# EAGLE design atmega32u4bb (EAGLE 5.11)
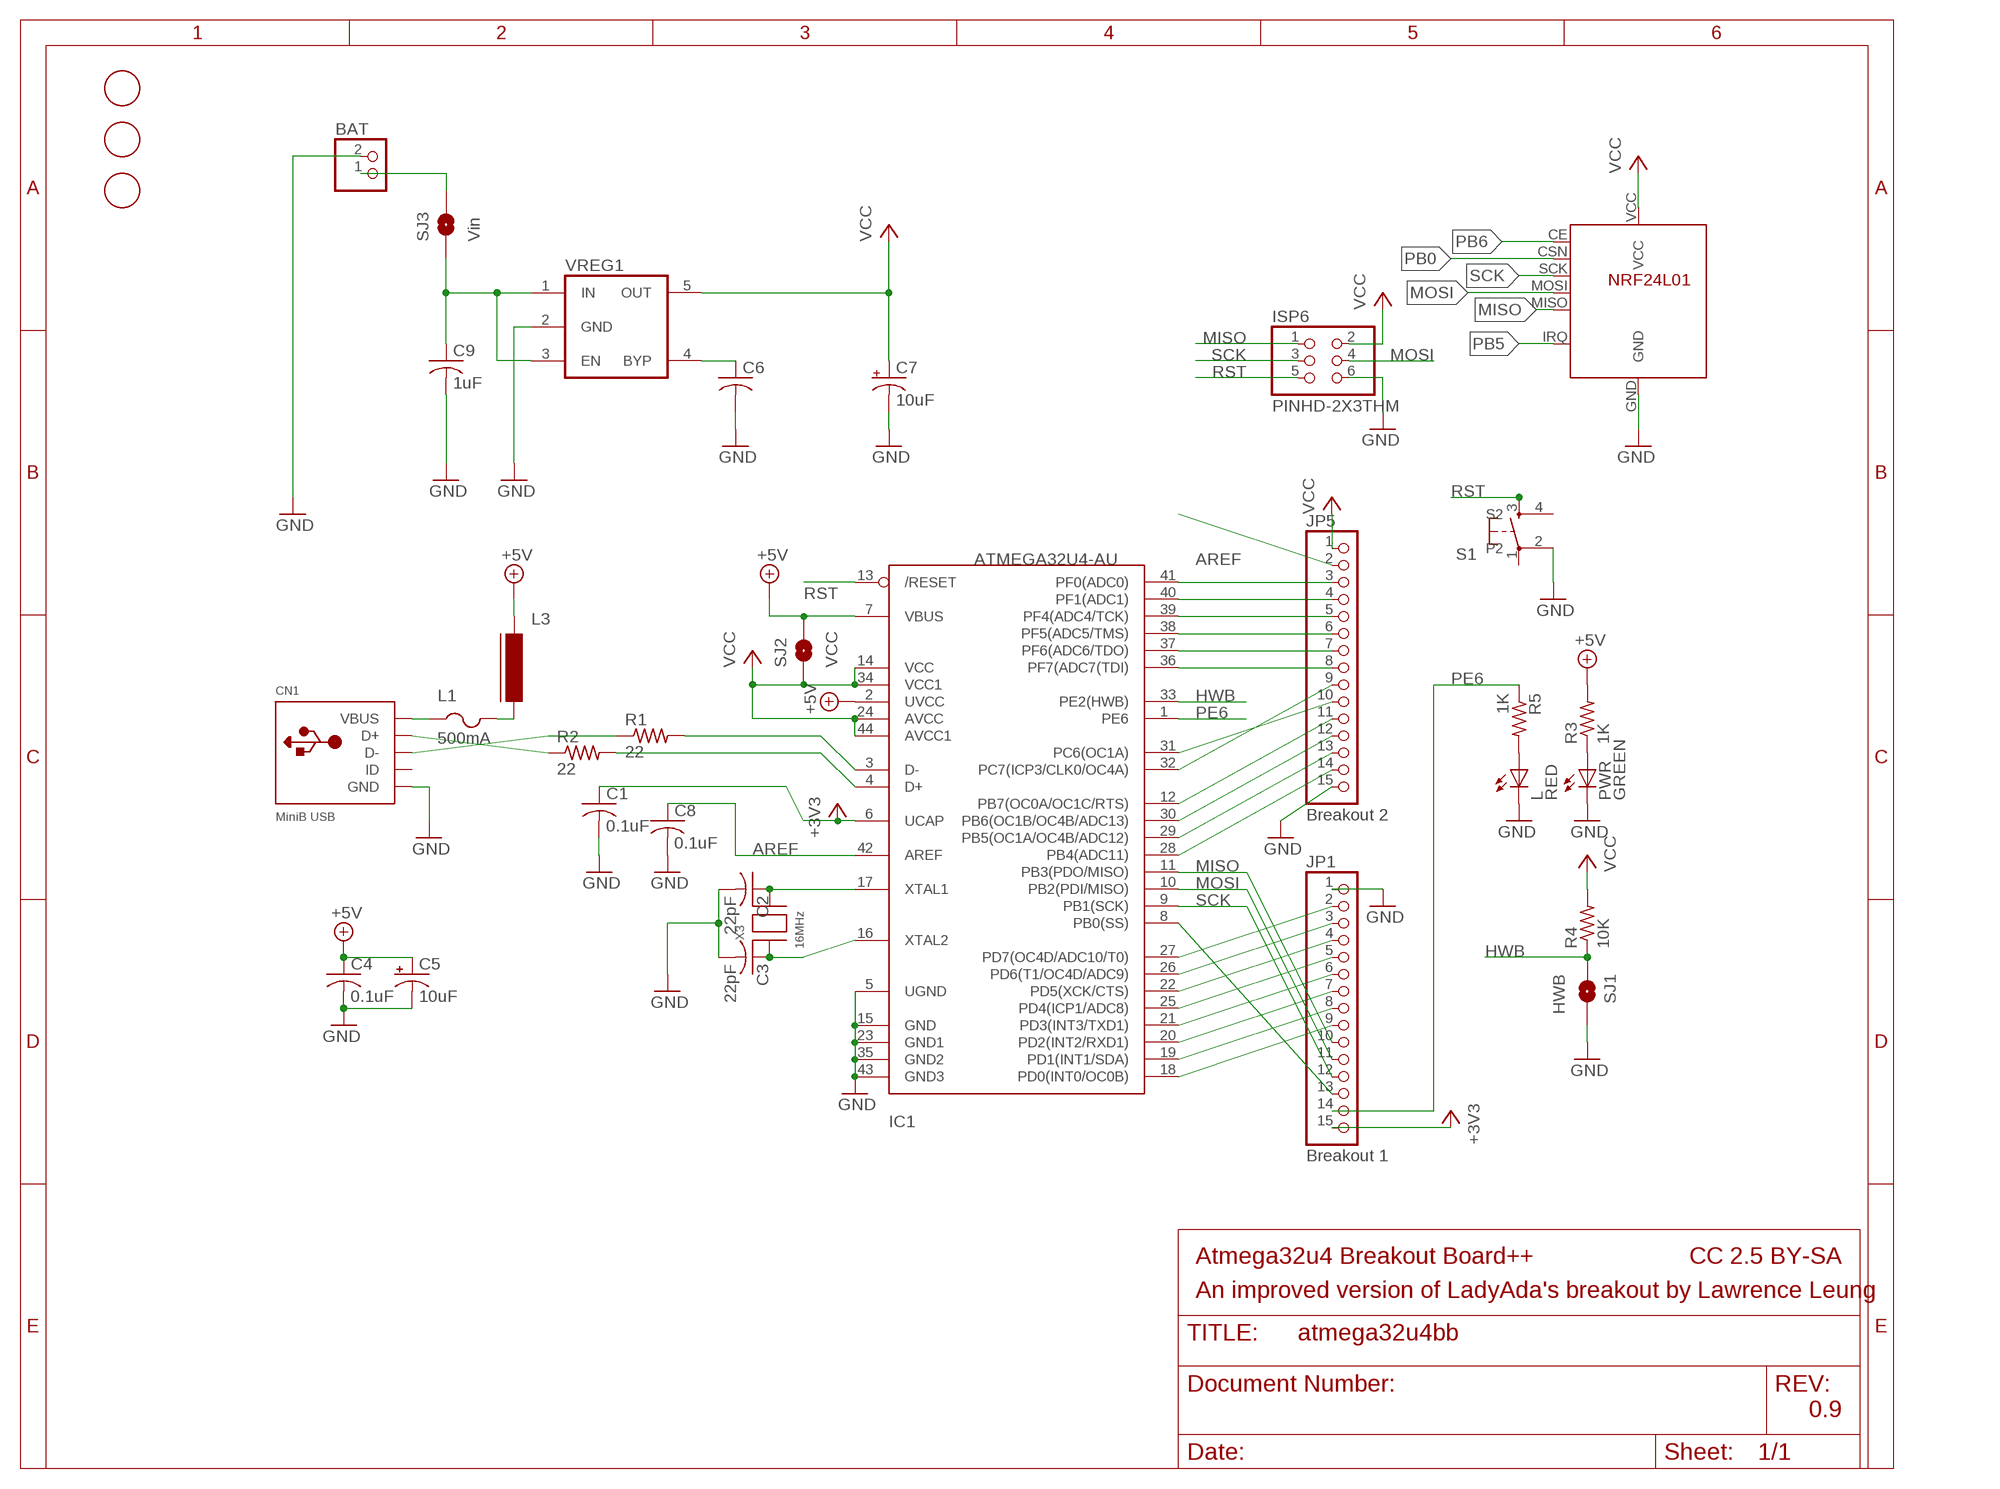
[diagram p0: schematic, sheet 1]

## Parts
BAT  JST_2PIN-THM-RA  [JST-PH-2-THM-RA]
C1  0.1uF  C-USC0603  [C0603]
C2  22pF  C-USC0603  [C0603]
C3  22pF  C-USC0603  [C0603]
C4  0.1uF  C-USC0603  [C0603]
C5  10uF  CPOL-USA/3216-18R  [A/3216-18R]
C6  C-USC0603  [C0603]
C7  10uF  CPOL-USA/3216-18R  [A/3216-18R]
C8  0.1uF  C-USC0603  [C0603]
C9  1uF  C-USC0603  [C0603]
CN1  MiniB USB  USBMINIB  [USB-MINIB]
IC1  ATMEGA32U4-AU  [TQFP44]
ISP6  PINHD-2X3THM  [ISP6]
JP1  Breakout 1  PINHD-1X15-CB  [1X15-CB]
JP5  Breakout 2  PINHD-1X15-CB  [1X15-CB]
L  RED  LEDCHIPLED_0805  [CHIPLED_0805]
L1  500mA  PTCFUSE-1206  [R1206]
L3  FERRITE-0603  [FB603]
PWR  GREEN  LEDCHIPLED_0805  [CHIPLED_0805]
R1  22  R-US_R0603  [R0603]
R2  22  R-US_R0603  [R0603]
R3  1K  R-US_R0603  [R0603]
R4  10K  R-US_R0603  [R0603]
R5  1K  R-US_R0603  [R0603]
RF1  NRF24L01-BREAKOUT  [NRF24L01-BREAKOUT-ITEAD]
S1  KMS221G  [KMS221G]
SJ1  HWB  SOLDERJUMPERTRACE  [SJ_2S-TRACE]
SJ2  VCC  SOLDERJUMPERTRACE  [SJ_2S-TRACE]
SJ3  Vin  SOLDERJUMPERTRACE  [SJ_2S-TRACE]
U$1  FIDUCIAL  [FIDUCIAL_1MM]
U$2  FIDUCIAL  [FIDUCIAL_1MM]
U$6  FIDUCIAL  [FIDUCIAL_1MM]
VREG1  IC_VREG_5PINS-SOT-23-5  [SOT-23-5]
X3  16MHz  XTALNX5032  [NX5032]

## Nets
+3V3: C1.1 IC1.6(UCAP) JP1.15
+5V: C4.1 C5.+ IC1.2(UVCC) IC1.7(VBUS) L3.1 R3.2 SJ2.2
AREF: C8.1 IC1.42(AREF) JP5.2
GND: BAT.2 C1.2 C2.2 C3.2 C4.2 C5.- C6.2 C7.- C8.2 C9.2 CN1.GND IC1.5(UGND) IC1.15(GND) IC1.23(GND1) IC1.35(GND2) IC1.43(GND3) ISP6.6 JP1.1 JP5.15 L.C PWR.C RF1.GND S1.2 SJ1.2 VREG1.2(GND)
HWB: IC1.33(PE2(HWB)) R4.1 SJ1.1
MISO: IC1.11(PB3(PDO/MISO)) ISP6.1 JP1.10 RF1.MISO
MOSI: IC1.10(PB2(PDI/MISO)) ISP6.4 JP1.11 RF1.MOSI
N$1: PWR.A R3.1
N$2: CN1.D+ R2.1
N$3: IC1.3(D-) R1.2
N$4: IC1.4(D+) R2.2
N$5: CN1.D- R1.1
N$6: L1.2 L3.2
N$7: L.A R5.2
N$8: C2.1 IC1.17(XTAL1) X3.P$2
N$9: C3.1 IC1.16(XTAL2) X3.P$1
N$12: C6.1 VREG1.4(BYP)
PB0: IC1.8(PB0(SS)) JP1.13 RF1.CSN
PB4: IC1.28(PB4(ADC11)) JP5.14
PB5: IC1.29(PB5(OC1A/OC4B/ADC12)) JP5.13 RF1.IRQ
PB6: IC1.30(PB6(OC1B/OC4B/ADC13)) JP5.12 RF1.CE
PB7: IC1.12(PB7(OC0A/OC1C/RTS)) JP5.11
PC6: IC1.31(PC6(OC1A)) JP5.10
PC7: IC1.32(PC7(ICP3/CLK0/OC4A)) JP5.9
PD0: IC1.18(PD0(INT0/OC0B)) JP1.9
PD1: IC1.19(PD1(INT1/SDA)) JP1.8
PD2: IC1.20(PD2(INT2/RXD1)) JP1.7
PD3: IC1.21(PD3(INT3/TXD1)) JP1.6
PD4: IC1.25(PD4(ICP1/ADC8)) JP1.5
PD5: IC1.22(PD5(XCK/CTS)) JP1.4
PD6: IC1.26(PD6(T1/OC4D/ADC9)) JP1.3
PD7: IC1.27(PD7(OC4D/ADC10/T0)) JP1.2
PE6: IC1.1(PE6) JP1.14 R5.1
PF0: IC1.41(PF0(ADC0)) JP5.3
PF1: IC1.40(PF1(ADC1)) JP5.4
PF4: IC1.39(PF4(ADC4/TCK)) JP5.5
PF5: IC1.38(PF5(ADC5/TMS)) JP5.6
PF6: IC1.37(PF6(ADC6/TDO)) JP5.7
PF7: IC1.36(PF7(ADC7(TDI)) JP5.8
RST: IC1.13(/RESET) ISP6.5 S1.3(S)
SCK: IC1.9(PB1(SCK)) ISP6.3 JP1.12 RF1.SCK
VBAT: BAT.1 SJ3.2
VBUS: CN1.VBUS L1.1
VCC: C7.+ IC1.14(VCC) IC1.24(AVCC) IC1.34(VCC1) IC1.44(AVCC1) ISP6.2 JP5.1 R4.2 RF1.VCC SJ2.1
VIN: C9.1 SJ3.1 VREG1.1(IN) VREG1.3(EN)
Unconnected: CN1.ID S1.1(P) S1.4(S2) VREG1.5(OUT)

## Notes on the sheet
- Atmega32u4 Breakout Board++ | CC 2.5 BY-SA
- An improved version of LadyAda's breakout by Lawrence Leung
- 0.9

## Library data of the parts
BAT = adafruit:JST_2PIN: JST 2-Pin Connectors of various flavors SMT-RA (S2B-PH-SM4) 4UConnector #17311 SMT (B2B-PH-SM4) THM-RA (S2B-PH) THM (B2B-PH)
C1-C4 C6 C8 C9 = LL:C-US: CAPACITOR, American symbol
C5 C7 = LL:CPOL-US: POLARIZED CAPACITOR, American symbol Footprints somewhat modified from Adafruits (1206)
CN1 = adafruit:USB: USB Connectors USBMINIB - Surface Mount Female Mini-B USB Connector 4UConnector: 06564 By microbuilder.eu Thru-hole RA Female Mini-B USB Connector 4UConnector: 18732 By ladyada.net
IC1 = adaprog:ATMEGA32U4
ISP6 = adaprog:PINHD-2X3
JP1 JP5 = adafruit:PINHD-1X15: PIN HEADER
L PWR = adafruit:LED: LED OSRAM: - CHIPLED LG R971, LG N971, LY N971, LG Q971, LY Q971, LO R971, LY R971 LH N974, LH R974 LS Q976, LO Q976, LY Q976 LO Q996 - Hyper CHIPLED LW Q18S LB Q993, LB Q99A, LB R99A - SideLED LS A670, LO A670, LY A670, LG A670, LP A670 LB A673, LV A673, LT A673, LW A673 LH A674 LY A675 LS A676, LA A676, LO A676, LY A676, LW A676 LS A679, LY A679, LG A679 - Hyper Micro SIDELED® LS Y876, LA Y876, LO Y876, LY Y876 LT Y87S - SmartLED LW L88C, LW L88S LB L89C, LB L89S, LG L890 LS L89K, LO L89K, LY L89K LS L896, LA L896, LO L896, LY L896 - TOPLED LS T670, LO T670, LY T670, LG T670, LP T670 LSG T670, LSP T670, LSY T670, LOP T670, LYG T670 LG T671, LOG T671, LSG T671 LB T673, LV T673, LT T673, LW T673 LH T674 LS T676, LA T676, LO T676, LY T676, LB T676, LH T676, LSB T676, LW T676 LB T67C, LV T67C, LT T67C, LS T67K, LO T67K, LY T67K, LW E67C LS E67B, LA E67B, LO E67B, LY E67B, LB E67C, LV E67C, LT E67C LW T67C LS T679, LY T679, LG T679 LS T770, LO T770, LY T770, LG T770, LP T770 LB T773, LV T773, LT T773, LW T773 LH T774 LS E675, LA E675, LY E675, LS T675 LS T776, LA T776, LO T776, LY T776, LB T776 LHGB T686 LT T68C, LB T68C - Hyper Mini TOPLED® LB M676 - Mini TOPLED Santana® LG M470 LS M47K, LO M47K, LY M47K Source: http://www.osram.convergy.de/
L1 = adafruit:PTCFUSE: PTC fuses, resettable thermistors
L3 = dp_devices:FERRITE: Ferrite bead in various packages
R1-R5 = LL:R-US_: RESISTOR, American symbol
RF1 = LL:NRF24L01-BREAKOUT: NRF23L01 breakout; FREQ: 2.4GHZ
S1 = LL:KMS221G: LOW PROFILE PUSHBUTTON SWITCH KMS221G
SJ1-SJ3 = SparkFun:SOLDERJUMPER: Solder Jumper Standard SMD solder jumper. Used to automate production. Two varients : Normally Open and Normally Closed are the same, but have different paste layers. NC will have a large amount of paste and should jumper during reflow.
U$1 U$2 U$6 = adafruit:FIDUCIAL: For use by pick and place machines to calibrate the vision/machine, 1mm By microbuilder.eu
VREG1 = dp_devices:IC_VREG_5PINS: 5 pins voltage regulator
X3 = adaprog:XTAL

## Board
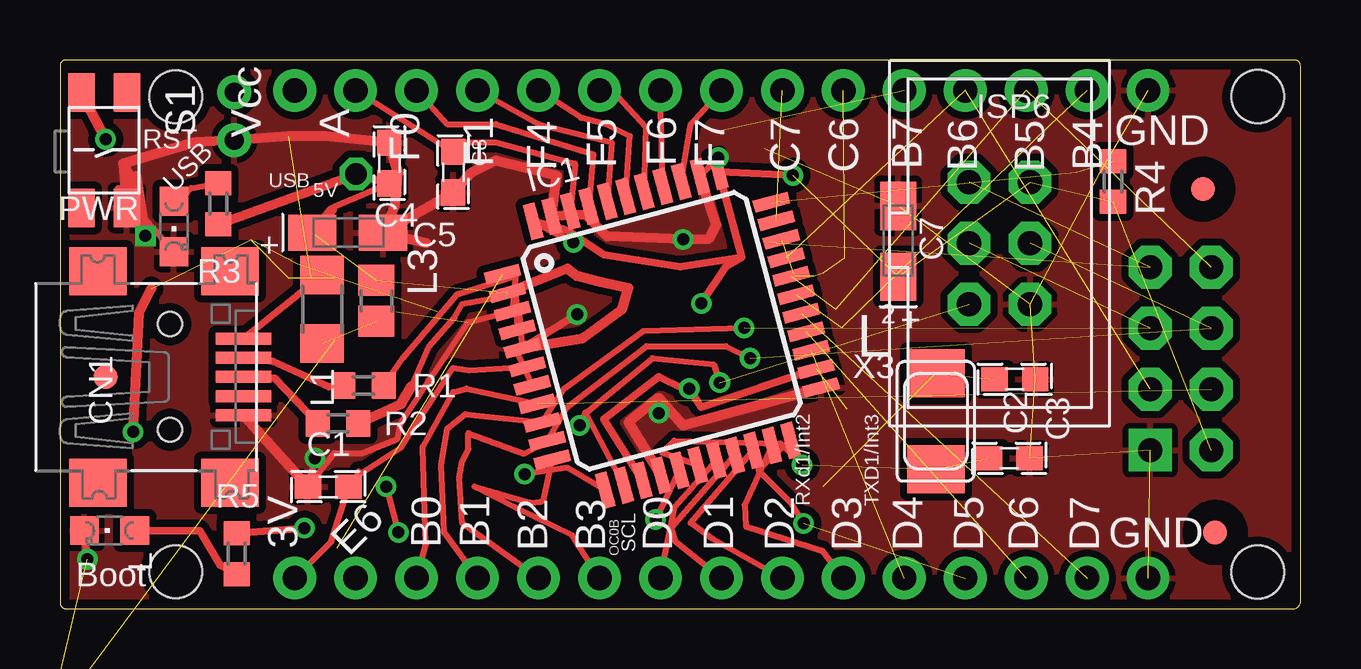
[diagram p1: board, top side]
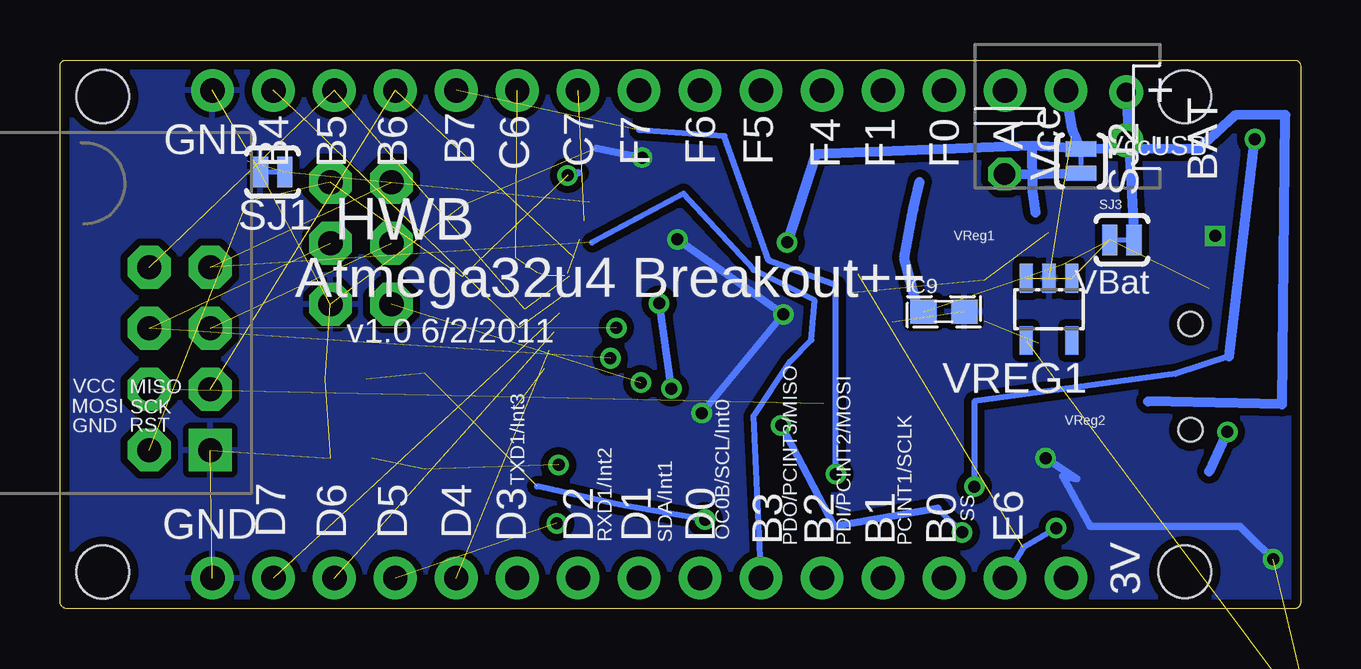
[diagram p2: board, bottom side, seen from below]

Size 51.69 x 22.87 mm. Coordinates in mm from the lower left corner, seen from the top.
Outline: 0.25,22.87 arc90 0,22.61 0,0.26 arc90 0.25,0.01 51.31,0.01 arc90 51.69,0.26 51.69,22.61 arc90 51.44,22.87 0.25,22.87
Copper layers (1*16): Top 0.0356mm / dielectric 1.5011mm / Bottom 0.0356mm
Design rules "LaenPCBOrder-LL": minimum track width 6mil, minimum drill 13mil, track to track 6mil, track to pad 6mil, pad to pad 6mil, via to via 6mil, smd to smd 6mil, copper to edge 15mil, drill to drill 6mil, minimum pad ring 7mil, minimum via ring 7mil, stop-mask expansion 4mil, vias tented up to drill 25mil, thermal gap 10mil
Holes 2.2 mm at 4.83,21.33 4.83,1.55 49.91,21.34 49.91,1.53

### Footprints (pad centres in the part's own frame; a part is rotated, then mirrored left to right if it is on the bottom)
JST-PH-2-THM-RA = drill 0.8 pad 1.422 round: 1 1,0; 2 -1,0
C0603 = smd 1.1 x 1: 1 -0.85,0; 2 0.85,0
A/3216-18R = smd 2.007 x 1.5: + 1.502,0 | smd 2.025 x 1.5: - -1.451,0
USB-MINIB = smd 0.5 x 2.308: D+ 0,4.064; D- -0.8,4.064; GND 1.6,4.064; ID 0.8,4.064; VBUS -1.6,4.064 | smd 2 x 2.4: GND1 -4.4,-2; GND2 -4.4,3.5; GND3 4.4,3.5; GND4 4.4,-2 | hole 1: -2.2,1; 2.2,1
TQFP44 = smd 1.5 x 0.5: 1 -5.8,4; 2 -5.8,3.2; 3 -5.8,2.4; 4 -5.8,1.6; 5 -5.8,0.8; 6 -5.8,0; 7 -5.8,-0.8; 8 -5.8,-1.6; 9 -5.8,-2.4; 10 -5.8,-3.2; 11 -5.8,-4; 23 5.8,-4; 24 5.8,-3.2; 25 5.8,-2.4; 26 5.8,-1.6; 27 5.8,-0.8; 28 5.8,0; 29 5.8,0.8; 30 5.8,1.6; 31 5.8,2.4; 32 5.8,3.2; 33 5.8,4 | smd 0.5 x 1.5: 12 -4,-5.8; 13 -3.2,-5.8; 14 -2.4,-5.8; 15 -1.6,-5.8; 16 -0.8,-5.8; 17 0,-5.8; 18 0.8,-5.8; 19 1.6,-5.8; 20 2.4,-5.8; 21 3.2,-5.8; 22 4,-5.8; 34 4,5.8; 35 3.2,5.8; 36 2.4,5.8; 37 1.6,5.8; 38 0.8,5.8; 39 0,5.8; 40 -0.8,5.8; 41 -1.6,5.8; 42 -2.4,5.8; 43 -3.2,5.8; 44 -4,5.8
ISP6 = drill 1.016 pad 1.778 octagon: 1 -2.54,-1.27; 2 -2.54,1.27; 3 0,-1.27; 4 0,1.27; 5 2.54,-1.27; 6 2.54,1.27
1X15-CB = drill 1.016 pad 1.778 round: 1 -17.78,0; 2 -15.24,0; 3 -12.7,0; 4 -10.16,0; 5 -7.62,0; 6 -5.08,0; 7 -2.54,0; 8 0,0; 9 2.54,0; 10 5.08,0; 11 7.62,0; 12 10.16,0; 13 12.7,0; 14 15.24,0; 15 17.78,0
CHIPLED_0805 = smd 1.2 x 1.2: A 0,-1.05; C 0,1.05
R1206 = smd 1.6 x 1.803: 1 -1.422,0; 2 1.422,0
FB603 = smd 1.3 x 1.5: 1 -0.85,0; 2 0.85,0
R0603 = smd 1 x 1.1: 1 -0.85,0; 2 0.85,0
NRF24L01-BREAKOUT-ITEAD = drill 1 pad 1.778 octagon: CE 13.306,-3.056; CSN 10.766,-3.056; IRQ 10.766,2.024; MISO 13.306,2.024; MOSI 10.766,-0.516; SCK 13.306,-0.516; VCC 10.766,-5.596 | drill 1 pad 1.778 square: GND 13.306,-5.596
KMS221G = smd 1.6 x 1.1: 1 -2.378,0.938; 2 2.422,0.938; 3 -2.378,-0.962; 4 2.422,-0.962
SJ_2S-TRACE = smd 0.635 x 1.27: 1 -0.508,0; 2 0.508,0
FIDUCIAL_1MM = smd 1 x 1: 1 0,0
SOT-23-5 = smd 0.55 x 1.2: 1 -0.95,-1.3; 2 0,-1.3; 3 0.95,-1.3; 4 0.95,1.3; 5 -0.95,1.3
NX5032 = smd 2 x 2.4: P$1 2,0; P$2 -2,0

### Placement (x,y rotation side)
BAT  7.26,20.53 90 bottom
C1  11.18,5.09 180 top
C2  39.55,6.27 0 top
C3  39.78,9.56 0 top
C4  13.73,18.57 90 top
C5  12.01,15.68 180 top
C6  -2.12,-8.12 0 top  (outside the outline)
C7  34.92,15.33 270 top
C8  16.38,18.19 270 top
C9  14.86,12.38 0 bottom
CN1  3.58,9.66 270 top
IC1  25.08,11.58 15 top
ISP6  39.15,15.23 270 top
JP1  27.56,1.28 180 top
JP5  27.56,21.6 0 top
L  2.07,3.26 90 top
L1  10.92,12.48 270 top
L3  13.18,12.83 270 top
PWR  4.75,15.93 180 top
R1  12.65,9.3 0 top
R2  11.58,7.73 0 top
R3  6.59,16.88 270 top
R4  43.88,17.8 270 top
R5  7.37,2.29 270 top
RF1  58.73,12.21 0 bottom
S1  1.85,19.13 270 top
SJ1  42.83,18.2 180 bottom
SJ2  9.15,18.65 270 bottom
SJ3  7.44,15.37 0 bottom
U$1  48.13,3.18 0 top
U$2  1.91,9.66 0 top
U$3  [L2LOGO]  33.89,11.1 0 top
U$6  47.62,17.49 0 top
VREG1  10.48,12.48 180 bottom
X3  36.49,7.82 90 top

### Tracks (layer width: path | path; a pad name or v marks a point on that pad's centre or on a via)
+3V3
  Top 0.254: IC1.6 17.04,9.94 16.38,10.04 14.22,6.74 12.45,5.59 12.45,5.72 12.32,5.34 C1.1 11.3,2.8 JP1.15
+5V  (via drill 0.9)  (2 unrouted)
  Top 0.254: C4.1 11.45,16.75 11.32,16.62 | 18.98,10.82 IC1.7
  Top 0.305: v12.33,18.11 C4.1
  Top 0.406: 11.32,16.62 C5.+ | IC1.2 21.14,14.17 21.52,13.87 22.54,13.61 23.68,13.36 23.43,12.47 21.77,11.28 18.98,10.82 | R3.2 v12.33,18.11
  Bottom 0.406: v12.33,18.11 SJ2.2
AREF
  Top 0.254: JP5.2 C8.1 16.89,19.44 18.16,19.44 21.46,18.55 IC1.42
GND  (via drill 0.5)  (11 unrouted)
  Top 0.254: PWR.C 2.41,17.53 S1.2 | IC1.35 v27.43,18.8 | IC1.5 19.11,12.47 17.02,11.94 14.2,7.73 14.07,7.09 12.57,6.48 11.43,6.48 C1.2 v10.62,6.28
  Top 0.305: v1.14,2.06 L.C | IC1.5 v21.54,12.27 | v24.95,8.15 24.95,8.79
  Top 0.406: C5.- 13.94,16.75 14.1,18.17 C4.2 11.05,19.69 9.52,19.69 BAT.2 5.64,19.43 2.63,18.55 | IC1.15 23.68,7.77 24.95,8.79 25.96,7.65 IC1.23 | IC1.35 27.35,15.98 27.04,15.42 v25.96,15.39 22.79,15.52 21.9,16.41 IC1.43 20.7,18.04 18.16,18.68 17.14,18.17 C8.2 C5.- | C1.2 CN1.GND | C5.- 15.24,15.25 | 2.63,18.55 S1.2 | 2.63,18.55 3.18,17.53 3.18,18.04 v3.56,15.54
  Bottom 0.305: v1.14,2.06 2.16,3.05 2.54,3.44 8.76,3.44 9.91,5.52 9.32,5.42 v10.62,6.28 | v27.43,18.8 29.34,19.18 | v25.96,15.39 v21.54,12.27 v24.95,8.15
  pour Top (isolate 0.305): -0.51,-0.12 -0.64,23.37 52.58,23.63 52.32,-0.5
  pour Bottom (isolate 0.305): -0.25,23.12 -0.13,-0.12 51.82,-0.37 52.2,23.37
HWB  (2 unrouted)
MISO  (2 unrouted)
  Top 0.254: JP1.10 21.34,3.05 18.98,4.22 17.27,5.09 19.59,4.42 20.05,4.47 20.15,4.54 IC1.11
  Bottom 0.254: 29.52,15.27 25.71,17.3 22.79,14.12 20.25,12.85 20.38,11.2 21.27,10.31 22.79,8.03 JP1.10
MOSI  (via drill 0.5)  (2 unrouted)
  Top 0.254: JP1.11 16.76,3.56 16.64,5.47 16.76,6.15 17.02,6.66 17.02,7.32 19.34,6.46 IC1.10 21.14,8.41 24.44,10.95 27.74,10.95 v28.76,10.44
N$1
  Top 0.203: 5.29,17.33 5.46,17.53
  Top 0.254: PWR.A 5.29,17.33 | 5.46,17.53 R3.1
N$2
  Top 0.305: R2.1 8.94,9.61 CN1.D+
N$3
  Top 0.254: R1.2 14.27,10.45 16.56,13.11 18.98,13.87 18.98,13.94 IC1.3
N$4
  Top 0.254: 14.63,9.25 15.37,10.93 16.43,12.12 16.76,12.71 18.98,13.11 18.98,13.14 IC1.4
  Top 0.406: R2.2 14.22,8.54 14.63,9.25
N$5
  Top 0.305: R1.1 11.2,9.25 8.86,10.32 CN1.D-
N$6  (1 unrouted)
N$7
  Top 0.305: L.A 5.82,3.26 6.68,1.81 R5.2
N$8  (via drill 0.5)  (2 unrouted)
  Top 0.254: v30.92,5.99 30.03,6.88 25.58,7.01 25.08,6.5 IC1.17
N$9  (via drill 0.5)  (2 unrouted)
  Top 0.254: v24.81,3.72 IC1.16
  Bottom 0.254: 31.81,5.11 28.38,4.34 v24.81,3.72
N$10  (via drill 0.6)
  other vias: 49.98,29.98
N$12  (1 unrouted)
PB0  (1 unrouted)
  Top 0.254: IC1.8 16.94,9.18 16.38,9.02 15.11,6.74 15.24,2.67 JP1.13
PB4  (3 unrouted)
PB5  (3 unrouted)
PB6  (2 unrouted)
PB7  (via drill 0.5)  (1 unrouted)
  Top 0.254: IC1.12 21.14,5.87 v19.36,5.61
  Bottom 0.254: v19.36,5.61 19.36,13.49 22.15,14.5 24,19.69 27.56,19.95
PC6  (5 unrouted)
  Top 0.254: 30.55,13.98 30.66,13.87
PC7  (1 unrouted)
PD0
  Top 0.254: IC1.18 25.62,4.25 JP1.9
PD1
  Top 0.254: JP1.8 25.65,2.8 25.48,3.38 IC1.19
PD2
  Top 0.254: IC1.20 26.28,3.58 27.18,2.93 JP1.7
PD3
  Top 0.254: IC1.21 28.53,4.32 28.57,3.44 31.75,2.42 JP1.6
PD4  (1 unrouted)
PD5  (via drill 0.5)  (1 unrouted)
  Top 0.254: IC1.22 29.1,5.78 30.41,4.47 v30.99,3.56
PD6  (1 unrouted)
PD7  (1 unrouted)
PE6  (via drill 0.5)  (1 unrouted)
  Top 0.305: R5.1 v10.18,3.36
  Bottom 0.254: JP1.14 11.56,2.55 v10.18,3.36
PF0
  Top 0.254: IC1.41 22.22,18.93 18.16,20.2 16.13,20.2 JP5.3
PF1
  Top 0.254: IC1.40 22.99,19.44 19.94,20.2 JP5.4
PF4
  Top 0.254: IC1.39 23.75,19.69 22.73,20.2 21.72,20.45 JP5.5
PF5
  Top 0.254: IC1.38 24.42,20.03 22.99,21.6 JP5.6
PF6
  Top 0.254: IC1.37 JP5.7
PF7
  Top 0.254: JP5.8 26.29,20.2 IC1.36
RST  (via drill 0.5)  (1 unrouted)
  Top 0.254: v27.49,9.42 27.23,10.19 24.7,10.44 21.9,8.15 IC1.13 | v13.59,5.09 v14.1,3.18
  Top 0.305: v21.65,7.65 21.9,8.15
  Top 0.406: v1.91,19.56 S1.3
  Bottom 0.254: v14.1,3.18 15.11,4.2 | v13.59,5.09 13.59,8.64 5.21,9.79 2.97,10.52
  Bottom 0.305: v21.65,7.65 19.43,3.44 15.11,4.2
  Bottom 0.406: 2.97,10.52 v1.91,19.56
SCK  (via drill 0.5)  (2 unrouted)
  Top 0.254: JP1.12 16,3.18 15.88,5.98 16.13,7.5 16.89,8.11 IC1.9 21.01,9.17 24.31,11.58 v28.5,11.71
VBAT
  Bottom 0.406: BAT.1 SJ3.2
VBUS
  Top 0.305: CN1.VBUS L1.1
VCC  (via drill 0.5)  (5 unrouted)
  Top 0.305: IC1.24 26.73,8.41 v26.22,9.17 25.96,9.17 24.95,9.68 22.66,7.9 IC1.14 | 28.4,14.65 27.74,14.25 v26.73,12.73 | 28.4,14.65 IC1.34 v30.54,18.06 | 28.4,14.65 25.84,14.25 22.66,14.76 21.14,15.77 IC1.44 v21.39,15.27
  Bottom 0.305: v26.73,12.73 v26.22,9.17 | v30.54,18.06 30.1,18.17
  Bottom 0.406: JP5.1 9.51,19.98 SJ2.1 | v21.39,15.27 20.19,18.93 11.2,19.29 | SJ2.1 11.2,19.29 | 11.05,16.52 11.18,17.41 11.2,19.29 | 6.35,8.64 0.76,8.52 0.64,20.58 2.74,20.56 4.29,19.16 SJ2.1
VIN  (via drill 0.5)  (5 unrouted)
  Top 0.406: v3.05,7.37 3.3,12.33 3.81,13.34
  Bottom 0.406: 15.88,17.79 16.13,16.64 16.51,14.61 15.88,12.2 C9.1 | v3.05,7.37 3.81,5.72

### Text on the board
tPlace: Vcc | A | F0 | F1 | F6 | C7 | C6 | B7 | F4 | F5 | F7 | B6 | B5 | B4 | RST | GND | USB | USB | 5V | 3V | E6 | RXd1/Int2 | TXD1/Int3 | B0 | B1 | GND | Boot | B2 | B3 | OC0B | SCL | D0 | D1 | D2 | D3 | D4 | D5 | D6 | D7
bPlace: Vcc | F5 | F6 | F7 | C7 | C6 | B7 | B6 | B5 | B4 | VccUSB | A | F0 | F1 | F4 | GND | VReg1 | HWB | VBat | Atmega32u4 Breakout++ | v1.0 6/2/2011 | MISO | VCC | VReg2 | SCK | MOSI | RST | GND | E6 | TXD1/Int3 | SS | 3V | B0 | PCINT1/SCLK | B1 | PDI/PCINT2/MOSI | B2 | PDO/PCINT3/MISO | B3 | OC0B/SCL/Int0 | D0 | SDA/Int1 | D1 | RXD1/Int2 | D2 | D3 | D4 | D5 | D6 | D7 | GND